# EAGLE design Schematic (EAGLE 9.6.2)
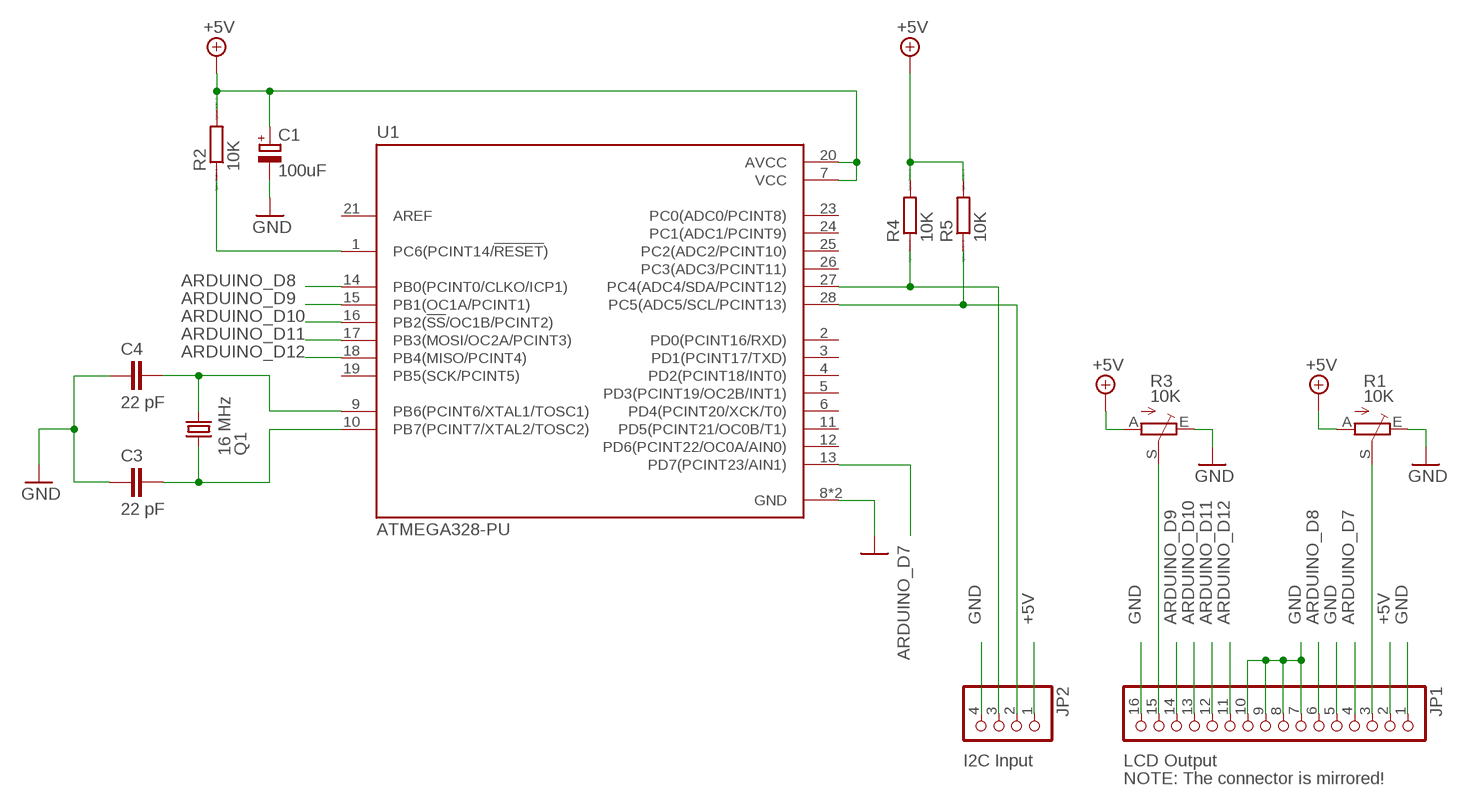
[diagram p0: schematic, sheet 1]

## Parts
C1  100uF  CPOL-EUE2,5-6E  [E2,5-6E]
C3  22 pF  C5/2.5  [C5B2.5]
C4  22 pF  C5/2.5  [C5B2.5]
JP1  PINHD-1X16  [1X16]
JP2  PINHD-1X4/90  [1X04/90]
Q1  16 MHz  CRYSTALHC49S  [HC49/S]
R1  10K  TRIM_EU-B25P  [B25P]
R2  10K  R0204/7  [0204/7]
R3  10K  TRIM_EU-B25P  [B25P]
R4  10K  R0204/7  [0204/7]
R5  10K  R0204/7  [0204/7]
U1  ATMEGA328-PU  [DIP787W46P254L3467H508Q28]

## Nets
+5V: C1.+ JP1.2 JP2.1 R1.A R2.2 R3.A R4.2 R5.2 U1.7(VCC) U1.20(AVCC)
ARDUINO_D7: JP1.4 U1.13(PD7(PCINT23/AIN1))
ARDUINO_D8: JP1.6 U1.14(PB0(PCINT0/CLKO/ICP1))
ARDUINO_D9: JP1.14 U1.15(PB1(OC1A/PCINT1))
ARDUINO_D10: JP1.13 U1.16(PB2(!SS!/OC1B/PCINT2))
ARDUINO_D11: JP1.12 U1.17(PB3(MOSI/OC2A/PCINT3))
ARDUINO_D12: JP1.11 U1.18(PB4(MISO/PCINT4))
GND: C1.- C3.1 C4.1 JP1.1 JP1.5 JP1.7 JP1.8 JP1.9 JP1.10 JP1.16 JP2.4 R1.E R3.E U1.8(GND) U1.22(GND)
N$1: JP1.15 R3.S
N$2: JP2.3 R4.1 U1.27(PC4(ADC4/SDA/PCINT12))
N$3: JP1.3 R1.S
N$4: JP2.2 R5.1 U1.28(PC5(ADC5/SCL/PCINT13))
N$14: C4.2 Q1.2 U1.9(PB6(PCINT6/XTAL1/TOSC1))
N$15: C3.2 Q1.1 U1.10(PB7(PCINT7/XTAL2/TOSC2))
N$17: R2.1 U1.1(PC6(PCINT14/!RESET!))
Unconnected: U1.2(PD0(PCINT16/RXD)) U1.3(PD1(PCINT17/TXD)) U1.4(PD2(PCINT18/INT0)) U1.5(PD3(PCINT19/OC2B/INT1)) U1.6(PD4(PCINT20/XCK/T0)) U1.11(PD5(PCINT21/OC0B/T1)) U1.12(PD6(PCINT22/OC0A/AIN0)) U1.19(PB5(SCK/PCINT5)) U1.21(AREF) U1.23(PC0(ADC0/PCINT8)) U1.24(PC1(ADC1/PCINT9)) U1.25(PC2(ADC2/PCINT10)) U1.26(PC3(ADC3/PCINT11))

## Notes on the sheet
- I2C Input | LCD Output
- NOTE: The connector is mirrored!

## Library data of the parts
C1 = rcl:CPOL-EU: POLARIZED CAPACITOR, European symbol; SPICEPREFIX: C
C3 C4 = capacitor-wima:C: CAPACITOR naming: grid - package width
JP1 = pinhead:PINHD-1X16: PIN HEADER
JP2 = pinhead:PINHD-1X4: PIN HEADER
Q1 = crystal:CRYSTAL: CRYSTAL; OC_FARNELL: 1667008; OC_NEWARK: unknown
R1 R3 = pot:TRIM_EU-: POTENTIOMETER
R2 R4 R5 = eagle-ltspice:R: RESISTOR, European symbol; SPICEMODEL: NONE; SPICEPREFIX: R
U1 = ATMEGA328-PU:ATMEGA328-PU: AVR AVR® ATmega Microcontroller IC 8-Bit 20MHz 32KB (16K x 16) FLASH 28-PDIP Check prices <https://pricing.snapeda.com/parts/ATMEGA328-PU/Microchip%20Technology/view-part?ref=eda>; AVAILABILITY: Good; DESCRIPTION: AVR AVR® ATmega Microcontroller IC 8-Bit 20MHz 32KB (16K x 16) FLASH 28-PDIP; MF: Microchip Technology; MP: ATMEGA328-PU; PACKAGE: DIP-28 Microchip Technology; PRICE: None; PURCHASE-URL: https://pricing.snapeda.com/search/part/ATMEGA328-PU/?ref=eda

## Board
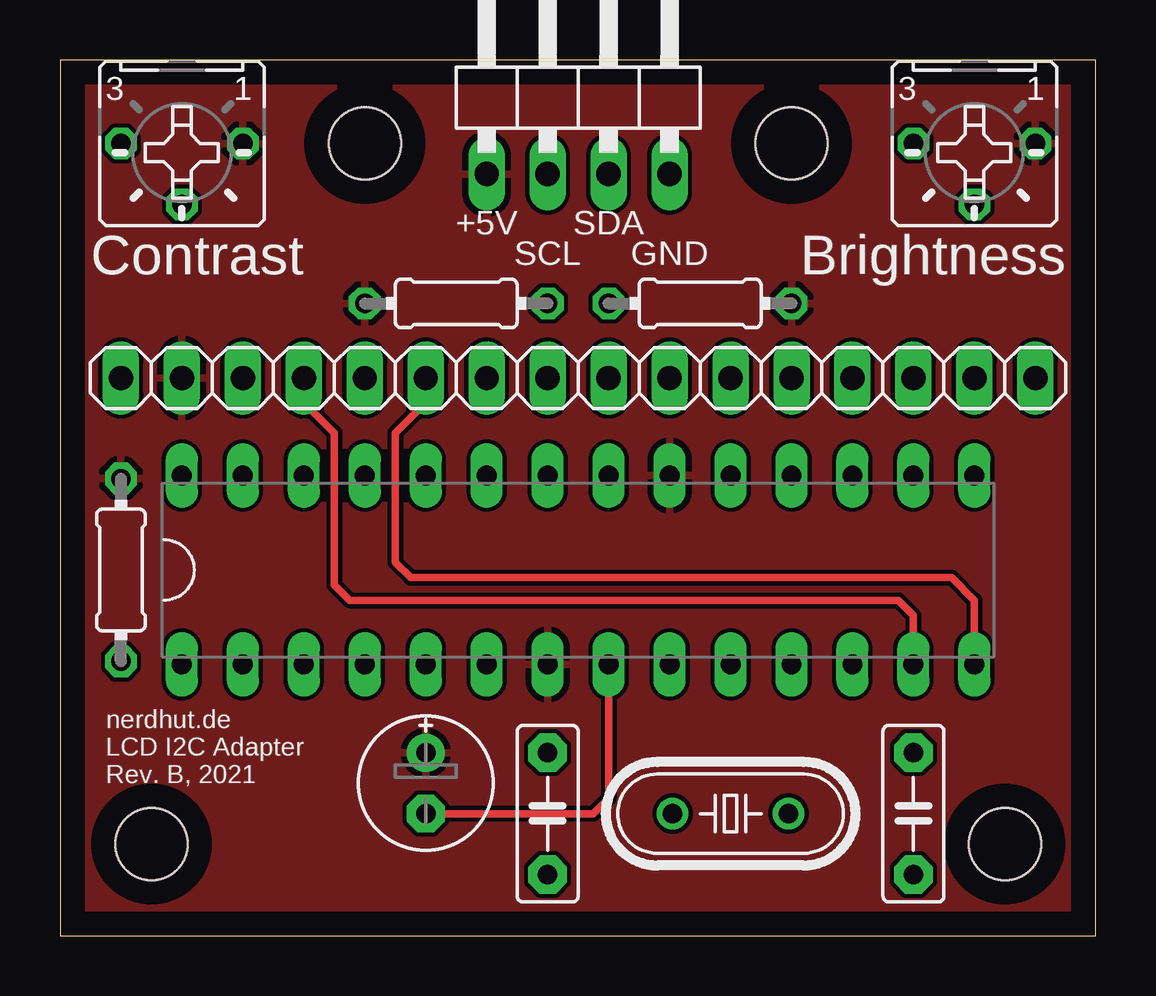
[diagram p1: board, top side]
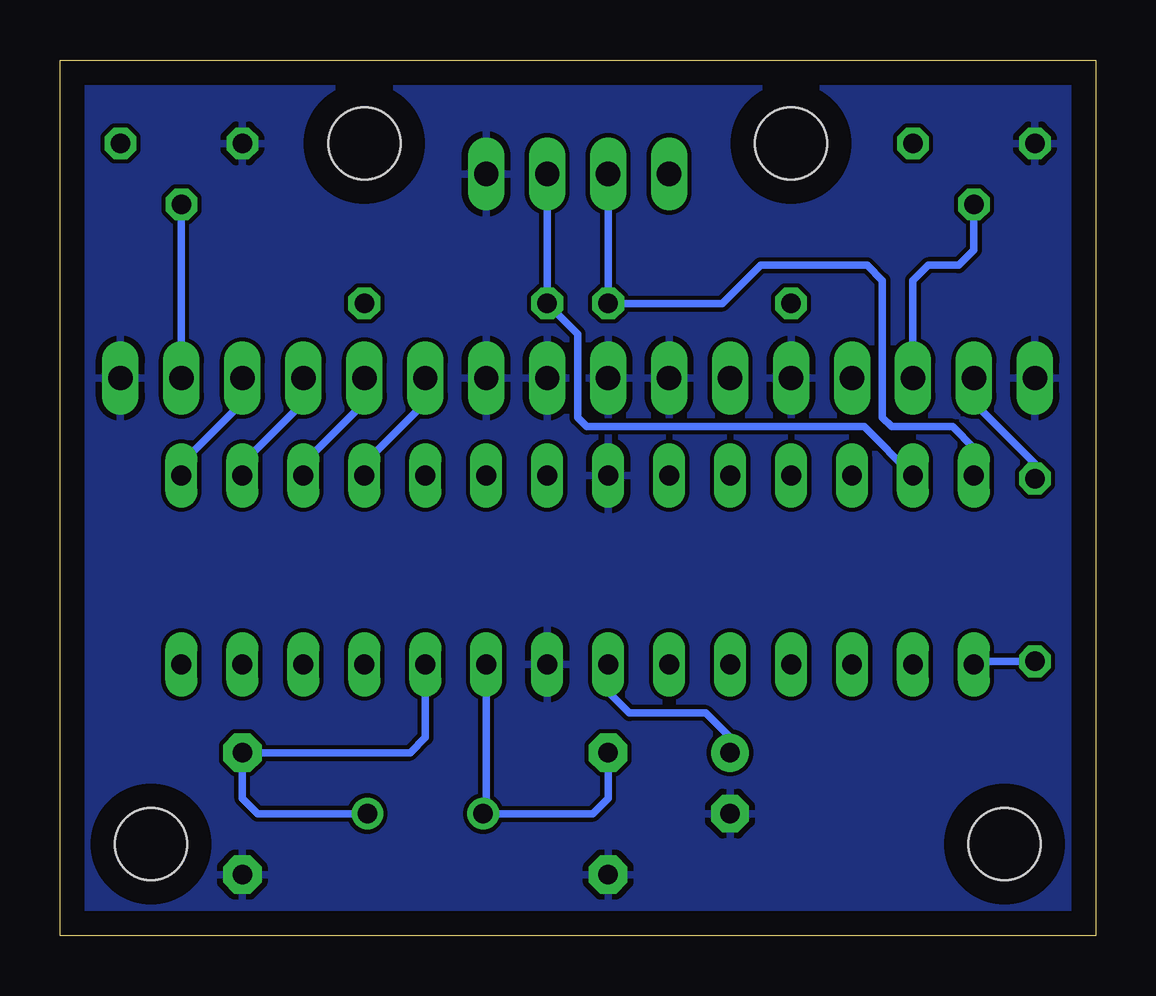
[diagram p2: board, bottom side, seen from below]

Size 43.16 x 36.5 mm. Coordinates in mm from the lower left corner, seen from the top.
Outline: 0,0 43.16,0 43.16,36.5 0,36.5 0,0
Copper layers (1*16): Top 0.035mm / dielectric 1.5mm / Bottom 0.035mm
Design rules "default": minimum track width 6mil, minimum drill 0.35mm, track to track 6mil, track to pad 6mil, pad to pad 6mil, via to via 6mil, smd to smd 6mil, copper to edge 40mil, drill to drill 6mil, minimum pad ring 10mil, minimum via ring 8mil, stop-mask expansion 4mil, vias tented up to drill 0mil, thermal gap 10mil
Holes 3 mm at 12.7,33.02 30.48,33.02 3.81,3.81 39.37,3.81

### Footprints (pad centres in the part's own frame; a part is rotated, then mirrored left to right if it is on the bottom)
E2,5-6E = drill 0.813 pad 1.575: + -1.27,0 | drill 0.813 pad 1.575 octagon: - 1.27,0
C5B2.5 = drill 0.813 pad 1.6 octagon: 1 -2.54,0; 2 2.54,0
1X16 = drill 1.016 long: 1 -19.05,0; 2 -16.51,0; 3 -13.97,0; 4 -11.43,0; 5 -8.89,0; 6 -6.35,0; 7 -3.81,0; 8 -1.27,0; 9 1.27,0; 10 3.81,0; 11 6.35,0; 12 8.89,0; 13 11.43,0; 14 13.97,0; 15 16.51,0; 16 19.05,0
1X04/90 = drill 1.016 long: 1 -3.81,-3.81; 2 -1.27,-3.81; 3 1.27,-3.81; 4 3.81,-3.81
HC49/S = drill 0.813: 1 -2.413,0; 2 2.413,0
B25P = drill 0.813 octagon: A -2.54,0; E 2.54,0; S 0,2.54
0204/7 = drill 0.813 octagon: 1 -3.81,0; 2 3.81,0
DIP787W46P254L3467H508Q28 = drill 0.83 pad 1.25 long: 1 -3.937,16.51; 2 -3.937,13.97; 3 -3.937,11.43; 4 -3.937,8.89; 5 -3.937,6.35; 6 -3.937,3.81; 7 -3.937,1.27; 8 -3.937,-1.27; 9 -3.937,-3.81; 10 -3.937,-6.35; 11 -3.937,-8.89; 12 -3.937,-11.43; 13 -3.937,-13.97; 14 -3.937,-16.51; 15 3.937,-16.51; 16 3.937,-13.97; 17 3.937,-11.43; 18 3.937,-8.89; 19 3.937,-6.35; 20 3.937,-3.81; 21 3.937,-1.27; 22 3.937,1.27; 23 3.937,3.81; 24 3.937,6.35; 25 3.937,8.89; 26 3.937,11.43; 27 3.937,13.97; 28 3.937,16.51

### Placement (x,y rotation side)
C1  15.24,6.35 270 top
C3  35.56,5.08 90 top
C4  20.32,5.08 90 top
JP1  21.59,23.24 0 top
JP2  21.59,35.56 0 top
Q1  27.94,5.08 180 top
R1  5.08,33.02 180 top
R2  2.54,15.24 90 top
R3  38.1,33.02 180 top
R4  26.67,26.35 0 top
R5  16.51,26.35 180 top
U1  21.59,15.24 90 top

### Tracks (layer width: path | path; a pad name or v marks a point on that pad's centre or on a via)
+5V
  Bottom 0.305: R2.2 2.54,19.69 5.08,22.23 JP1.2 | U1.7 20.32,10.16 19.43,9.27 16.26,9.27 15.24,8.26 C1.+
  pour Top (isolate 0.178): 0,36.83 43.18,36.83 43.18,0 0,0
ARDUINO_D7
  Top 0.305: JP1.4 10.16,22.23 11.43,20.96 11.43,14.61 12.07,13.97 34.92,13.97 35.56,13.34 U1.13
ARDUINO_D8
  Top 0.305: JP1.6 15.24,22.23 13.97,20.96 13.97,15.56 14.61,14.92 37.15,14.92 38.1,13.97 U1.14
ARDUINO_D9
  Bottom 0.305: JP1.14 35.56,22.23 38.1,19.69 U1.15
ARDUINO_D10
  Bottom 0.305: JP1.13 33.02,22.23 35.56,19.69 U1.16
ARDUINO_D11
  Bottom 0.305: JP1.12 30.48,22.23 33.02,19.69 U1.17
ARDUINO_D12
  Bottom 0.305: U1.18 30.48,19.69 27.94,22.23 JP1.11
GND
  Top 0.305: U1.8 22.86,5.72 22.23,5.08 C1.-
  pour Bottom (isolate 0.178): 0,36.83 43.18,36.83 43.18,0 0,0
N$1
  Bottom 0.305: JP1.15 R3.S
N$2
  Bottom 0.305: U1.27 9.65,21.21 21.21,21.21 21.59,21.59 21.59,25.08 R4.1 JP2.3
N$3
  Bottom 0.305: R1.S 5.08,28.58 5.71,27.94 6.99,27.94 7.62,27.31 JP1.3
N$4
  Bottom 0.305: U1.28 5.08,20.32 5.97,21.21 8.51,21.21 8.89,21.59 8.89,27.31 9.53,27.94 13.97,27.94 15.56,26.35 R5.1 JP2.2
N$14
  Bottom 0.305: U1.9 25.4,5.21 Q1.2 20.96,5.08 20.32,5.72 C4.2
N$15
  Bottom 0.305: U1.10 27.94,8.26 28.57,7.62 C3.2 35.56,5.72 34.92,5.08 Q1.1
N$17
  Bottom 0.305: R2.1 4.95,11.43 U1.1

### Text on the board
tPlace: +5V | SDA | Contrast | Brightness | SCL | GND | nerdhut.de / LCD I2C Adapter / Rev. B, 2021